# EAGLE design ARE_adaptadora_PIC_44pin (EAGLE 6.5.0)
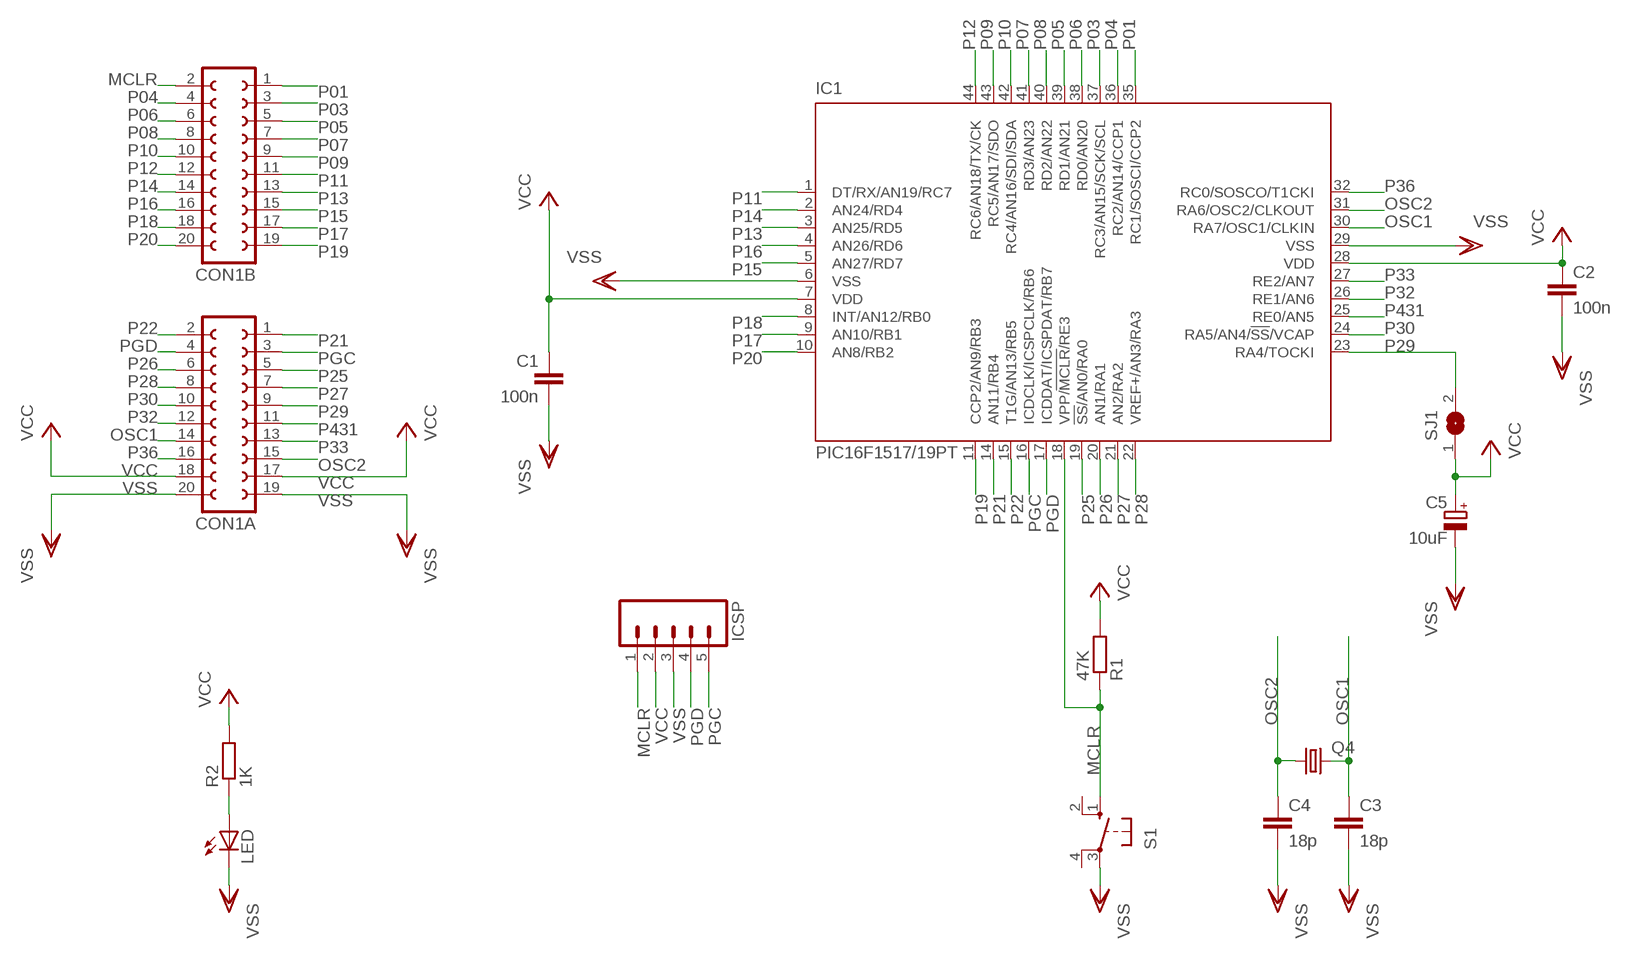
[diagram p0: schematic, sheet 1]

## Parts
C1  100n  C-EUC0805  [C0805]
C2  100n  C-EUC0805  [C0805]
C3  18p  C-EUC0805  [C0805]
C4  18p  C-EUC0805  [C0805]
C5  10uF  CPOL-EUSMCC  [SMC_C]
CON1A  FE10-2W  [FE10-2W]
CON1B  FE10-2W  [FE10-2W]
IC1  PIC16F1517/19PT  [TQFP44]
ICSP  M05PTH  [1X05]
LED  LEDCHIPLED_0805  [CHIPLED_0805]
Q4  CRYSTALHC18U-V  [HC18U-V]
R1  47K  R-EU_R0805  [R0805]
R2  1K  R-EU_R0805  [R0805]
S1  10-XX  [B3F-10XX]
SJ1  SJ  [SJ]

## Nets
MCLR: CON1B.2 IC1.18(VPP/!MCLR!/RE3) ICSP.1 R1.1 S1.1(S)
N$4: LED.A R2.1
OSC1: C3.1 CON1A.14 IC1.30(RA7/OSC1/CLKIN) Q4.2
OSC2: C4.1 CON1A.15 IC1.31(RA6/OSC2/CLKOUT) Q4.1
P01: CON1B.1 IC1.35(RC1/SOSCI/CCP2)
P03: CON1B.3 IC1.37(RC3/AN15/SCK/SCL)
P04: CON1B.4 IC1.36(RC2/AN14/CCP1)
P05: CON1B.5 IC1.39(RD1/AN21)
P06: CON1B.6 IC1.38(RD0/AN20)
P07: CON1B.7 IC1.41(RD3/AN23)
P08: CON1B.8 IC1.40(RD2/AN22)
P09: CON1B.9 IC1.43(RC5/AN17/SDO)
P10: CON1B.10 IC1.42(RC4/AN16/SDI/SDA)
P11: CON1B.11 IC1.1(DT/RX/AN19/RC7)
P12: CON1B.12 IC1.44(RC6/AN18/TX/CK)
P13: CON1B.13 IC1.3(AN25/RD5)
P14: CON1B.14 IC1.2(AN24/RD4)
P15: CON1B.15 IC1.5(AN27/RD7)
P16: CON1B.16 IC1.4(AN26/RD6)
P17: CON1B.17 IC1.9(AN10/RB1)
P18: CON1B.18 IC1.8(INT/AN12/RB0)
P19: CON1B.19 IC1.11(CCP2/AN9/RB3)
P20: CON1B.20 IC1.10(AN8/RB2)
P21: CON1A.1 IC1.14(AN11/RB4)
P22: CON1A.2 IC1.15(T1G/AN13/RB5)
P25: CON1A.5 IC1.19(!SS!/AN0/RA0)
P26: CON1A.6 IC1.20(AN1/RA1)
P27: CON1A.7 IC1.21(AN2/RA2)
P28: CON1A.8 IC1.22(VREF+/AN3/RA3)
P29: CON1A.9 IC1.23(RA4/TOCKI) SJ1.2
P30: CON1A.10 IC1.24(RA5/AN4/!SS!/VCAP)
P32: CON1A.12 IC1.26(RE1/AN6)
P33: CON1A.13 IC1.27(RE2/AN7)
P36: CON1A.16 IC1.32(RC0/SOSCO/T1CKI)
P431: CON1A.11 IC1.25(RE0/AN5)
PGC: CON1A.3 IC1.16(ICDCLK/ICSPCLK/RB6) ICSP.5
PGD: CON1A.4 IC1.17(ICDDAT/ICSPDAT/RB7) ICSP.4
VCC: C1.1 C2.1 C5.+ CON1A.17 CON1A.18 IC1.7(VDD) IC1.28(VDD) ICSP.2 R1.2 R2.2 SJ1.1
VSS: C1.2 C2.2 C3.2 C4.2 C5.- CON1A.19 CON1A.20 IC1.6(VSS) IC1.29(VSS) ICSP.3 LED.C S1.3(P)
Unconnected: S1.2(S1) S1.4(P1)

## Library data of the parts
C1-C4 = rcl:C-EU: CAPACITOR, European symbol
C5 = rcl:CPOL-EU: POLARIZED CAPACITOR, European symbol
CON1A CON1B = con-lsta:FE10-2W: FEMALE HEADER; OC_FARNELL: unknown; OC_NEWARK: unknown
IC1 = microchip:PIC16*F1517/19: 28/40/44-Pin Flash Microcontrollers with nanoWatt XLP Technology PIC16F1517/1519 AND PIC16LF1517/1519 Source: www.microchip.com PIC16F1516.pdf
ICSP = SparkFun:M05: Header 5 Standard 5-pin 0.1" header. Use with straight break away headers (SKU : PRT-00116), right angle break away headers (PRT-00553), swiss pins (PRT-00743), machine pins (PRT-00117), and female headers (PRT-00115). Molex polarized connector foot print use with SKU : PRT-08230 with associated crimp pins and housings.
LED = led:LED: LED OSRAM: - CHIPLED LG R971, LG N971, LY N971, LG Q971, LY Q971, LO R971, LY R971 LH N974, LH R974 LS Q976, LO Q976, LY Q976 LO Q996 - Hyper CHIPLED LW Q18S LB Q993, LB Q99A, LB R99A - SideLED LS A670, LO A670, LY A670, LG A670, LP A670 LB A673, LV A673, LT A673, LW A673 LH A674 LY A675 LS A676, LA A676, LO A676, LY A676, LW A676 LS A679, LY A679, LG A679 - Hyper Micro SIDELED® LS Y876, LA Y876, LO Y876, LY Y876 LT Y87S - SmartLED LW L88C, LW L88S LB L89C, LB L89S, LG L890 LS L89K, LO L89K, LY L89K LS L896, LA L896, LO L896, LY L896 - TOPLED LS T670, LO T670, LY T670, LG T670, LP T670 LSG T670, LSP T670, LSY T670, LOP T670, LYG T670 LG T671, LOG T671, LSG T671 LB T673, LV T673, LT T673, LW T673 LH T674 LS T676, LA T676, LO T676, LY T676, LB T676, LH T676, LSB T676, LW T676 LB T67C, LV T67C, LT T67C, LS T67K, LO T67K, LY T67K, LW E67C LS E67B, LA E67B, LO E67B, LY E67B, LB E67C, LV E67C, LT E67C LW T67C LS T679, LY T679, LG T679 LS T770, LO T770, LY T770, LG T770, LP T770 LB T773, LV T773, LT T773, LW T773 LH T774 LS E675, LA E675, LY E675, LS T675 LS T776, LA T776, LO T776, LY T776, LB T776 LHGB T686 LT T68C, LB T68C - Hyper Mini TOPLED® LB M676 - Mini TOPLED Santana® LG M470 LS M47K, LO M47K, LY M47K Source: http://www.osram.convergy.de LUXEON: - LUMILED® LXK2-PW12-R00, LXK2-PW12-S00, LXK2-PW14-U00, LXK2-PW14-V00 LXK2-PM12-R00, LXK2-PM12-S00, LXK2-PM14-U00 LXK2-PE12-Q00, LXK2-PE12-R00, LXK2-PE12-S00, LXK2-PE14-T00, LXK2-PE14-U00 LXK2-PB12-K00, LXK2-PB12-L00, LXK2-PB12-M00, LXK2-PB14-N00, LXK2-PB14-P00, LXK2-PB14-Q00 LXK2-PR12-L00, LXK2-PR12-M00, LXK2-PR14-Q00, LXK2-PR14-R00 LXK2-PD12-Q00, LXK2-PD12-R00, LXK2-PD12-S00 LXK2-PH12-R00, LXK2-PH12-S00 LXK2-PL12-P00, LXK2-PL12-Q00, LXK2-PL12-R00 Source: www.luxeon.com KINGBRIGHT: KA-3528ASYC Source: www.kingbright.com
Q4 = crystal:CRYSTAL: CRYSTAL; OC_FARNELL: unknown; OC_NEWARK: unknown
R1 R2 = rcl:R-EU_: RESISTOR, European symbol
S1 = switch-omron:10-XX: OMRON SWITCH; MPN: B3F-1000; OC_FARNELL: 176432; OC_NEWARK: 36M3542
SJ1 = jumper:SJ: SMD solder JUMPER

## Board
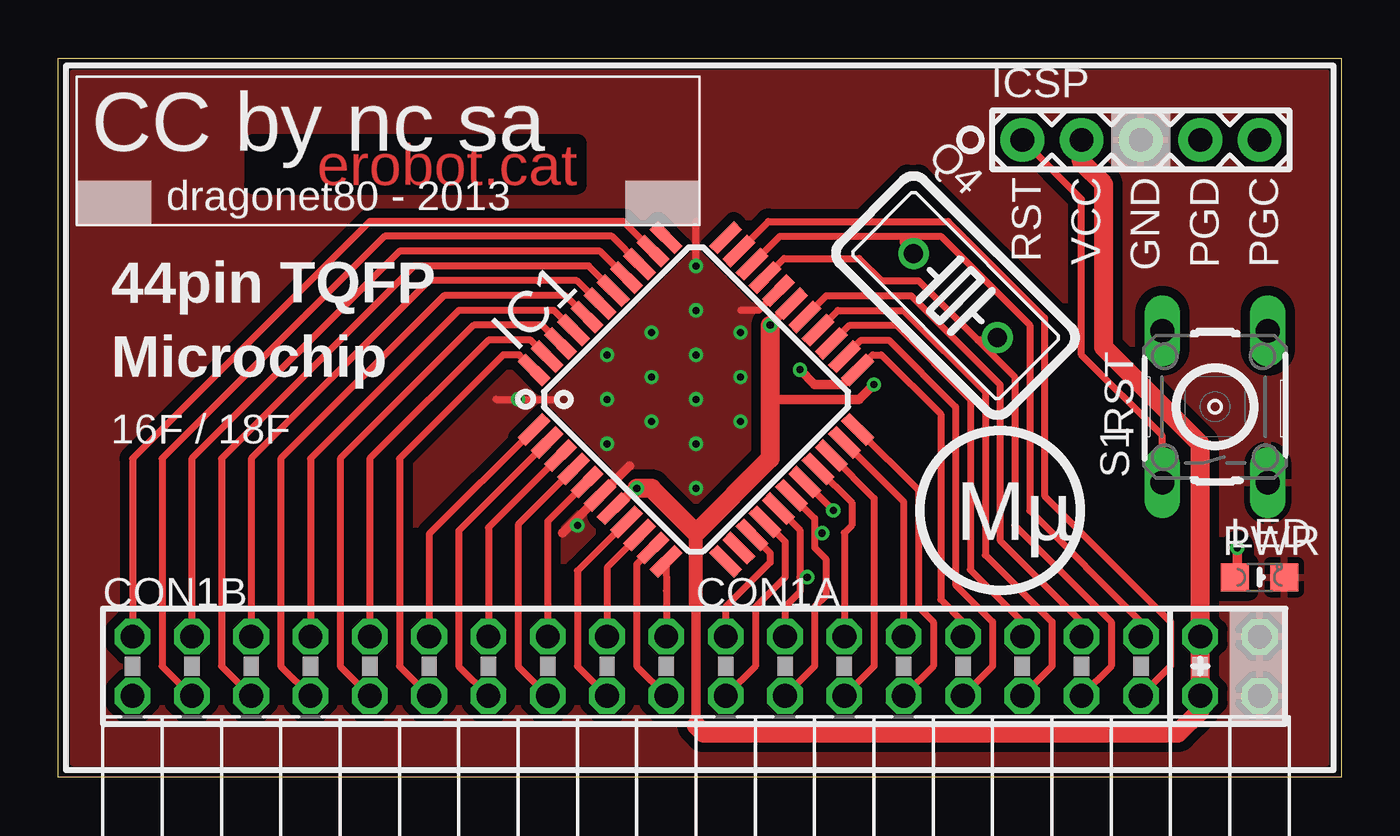
[diagram p1: board, top side]
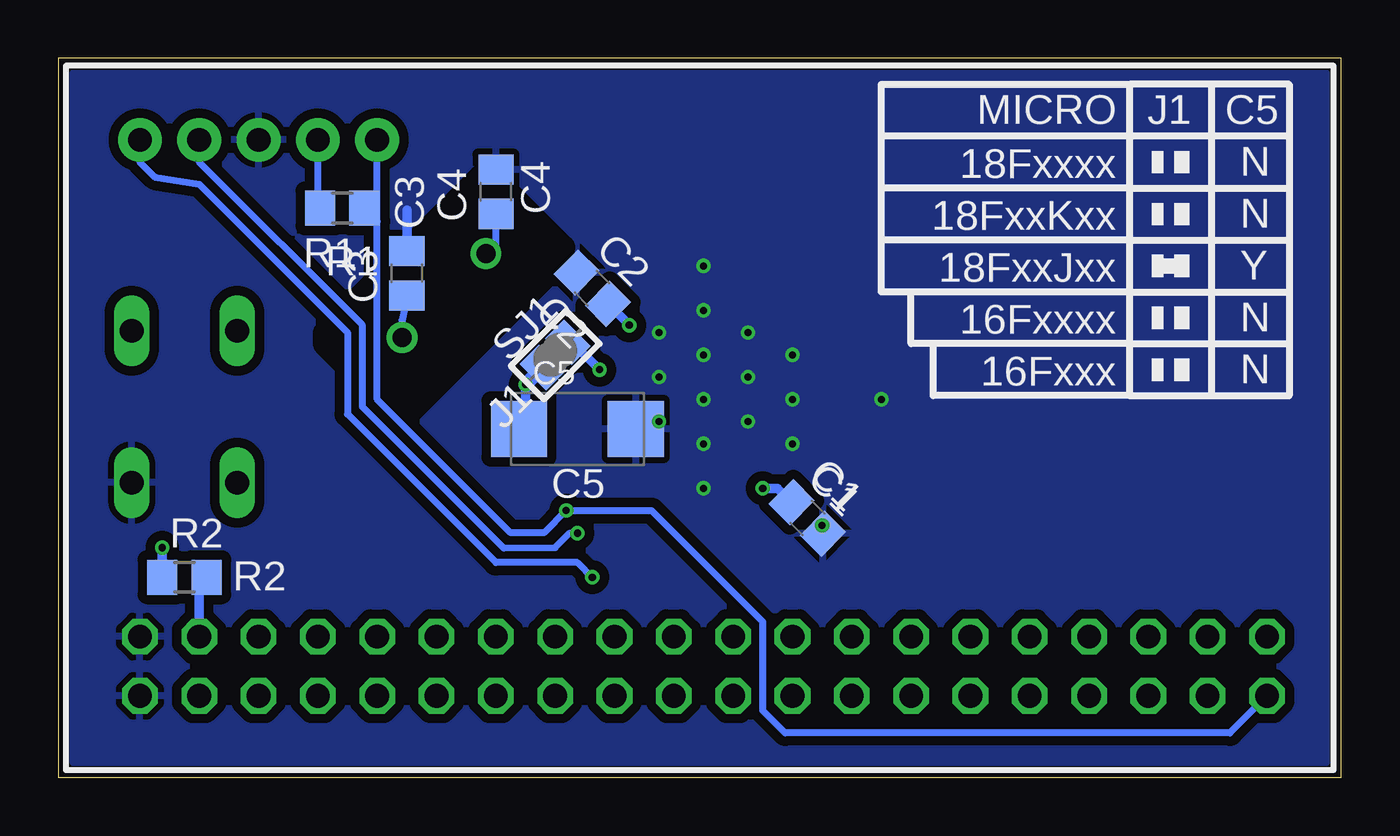
[diagram p2: board, bottom side, seen from below]

Size 54.93 x 30.8 mm. Coordinates in mm from the lower left corner, seen from the top.
Outline: 0,30.8 54.93,30.8 54.93,0 0,0 0,30.8
Copper layers (1*16): Top 0.035mm / dielectric 1.5mm / Bottom 0.035mm
Design rules "ITEADstudio_DRC": minimum track width 6mil, minimum drill 12mil, track to track 6mil, track to pad 6mil, pad to pad 6mil, via to via 6mil, smd to smd 0mil, copper to edge 10mil, drill to drill 10mil, minimum pad ring 10mil, minimum via ring 6mil, stop-mask expansion 2mil, vias tented up to drill 100mil, thermal gap 10mil
tRestrict: area 33.3,15.6 to 43.5,25.7
bRestrict: area 33.3,15.6 to 43.5,25.7

### Footprints (pad centres in the part's own frame; a part is rotated, then mirrored left to right if it is on the bottom)
C0805 = smd 1.3 x 1.5: 1 -0.95,0; 2 0.95,0
SMC_C = smd 2.4 x 2.4: + -2.5,0; - 2.5,0
FE10-2W = drill 1.016 octagon: 1 -11.43,1.27; 2 -11.43,-1.27; 3 -8.89,1.27; 4 -8.89,-1.27; 5 -6.35,1.27; 6 -6.35,-1.27; 7 -3.81,1.27; 8 -3.81,-1.27; 9 -1.27,1.27; 10 -1.27,-1.27; 11 1.27,1.27; 12 1.27,-1.27; 13 3.81,1.27; 14 3.81,-1.27; 15 6.35,1.27; 16 6.35,-1.27; 17 8.89,1.27; 18 8.89,-1.27; 19 11.43,1.27; 20 11.43,-1.27
TQFP44 = smd 1.5 x 0.5: 1 -5.8,4; 2 -5.8,3.2; 3 -5.8,2.4; 4 -5.8,1.6; 5 -5.8,0.8; 6 -5.8,0; 7 -5.8,-0.8; 8 -5.8,-1.6; 9 -5.8,-2.4; 10 -5.8,-3.2; 11 -5.8,-4; 23 5.8,-4; 24 5.8,-3.2; 25 5.8,-2.4; 26 5.8,-1.6; 27 5.8,-0.8; 28 5.8,0; 29 5.8,0.8; 30 5.8,1.6; 31 5.8,2.4; 32 5.8,3.2; 33 5.8,4 | smd 0.5 x 1.5: 12 -4,-5.8; 13 -3.2,-5.8; 14 -2.4,-5.8; 15 -1.6,-5.8; 16 -0.8,-5.8; 17 0,-5.8; 18 0.8,-5.8; 19 1.6,-5.8; 20 2.4,-5.8; 21 3.2,-5.8; 22 4,-5.8; 34 4,5.8; 35 3.2,5.8; 36 2.4,5.8; 37 1.6,5.8; 38 0.8,5.8; 39 0,5.8; 40 -0.8,5.8; 41 -1.6,5.8; 42 -2.4,5.8; 43 -3.2,5.8; 44 -4,5.8
1X05 = drill 1.016 pad 1.88: 1 0,0; 2 2.54,0; 3 5.08,0; 4 7.62,0; 5 10.16,0
CHIPLED_0805 = smd 1.2 x 1.2: A 0,-1.05; C 0,1.05
HC18U-V = drill 0.813: 1 -2.54,0; 2 2.54,0
R0805 = smd 1.3 x 1.5: 1 -0.95,0; 2 0.95,0
B3F-10XX = drill 1.016 long: 1 -3.251,2.261; 2 3.251,2.261; 3 -3.251,-2.261; 4 3.251,-2.261
SJ = smd 1.168 x 1.6: 1 -0.762,0; 2 0.762,0

### Placement (x,y rotation side)
C1  22.86,11.11 315 bottom
C2  32.07,20.96 135 bottom
C3  40,21.59 90 bottom
C4  36.19,25.08 90 bottom
C5  32.7,14.92 0 bottom
CON1A  40,4.76 0 top
CON1B  14.6,4.76 0 top
IC1  27.3,16.18 45 top
ICSP  41.27,27.31 0 top
LED  51.44,8.57 270 top
Q4  38.42,20.64 315 top
R1  42.77,24.38 180 bottom
R2  49.53,8.57 0 bottom
S1  49.53,15.88 90 top
SJ1  33.66,18.1 45 bottom

### Tracks (layer width: path | path; a pad name or v marks a point on that pad's centre or on a via)
MCLR  (via drill 0.3 pad 0.61)
  Top 0.305: IC1.18 v33.18,11.43 | S1.1 47.27,14.64 43.81,18.1 43.81,24.76 ICSP.1
  Bottom 0.305: 41.27,23.81 41.27,16.19 35.56,10.48 34.13,10.48 v33.18,11.43 29.53,11.43 24.77,6.67 24.77,2.86 23.81,1.9 4.76,1.9 CON1B.2 | R1.1 41.5,24.06 41.27,23.81 | 41.27,23.81 ICSP.1
N$4  (via drill 0.3 pad 0.61)
  Top 0.406: v50.48,9.84 50.48,8.89 LED.A
  Bottom 0.406: R2.1 v50.48,9.84
OSC1
  Top 0.305: IC1.30 31.08,22.22 34.29,22.22 35.24,21.27 36.83,21.27 39.37,18.73 | CON1A.14 45.08,4.76 45.08,6.67 40.96,10.79 40.96,17.14 39.37,18.73 | Q4.2 40.11,18.73 39.37,18.73
  Bottom 0.305: C3.1 40.21,19.57 Q4.2
OSC2
  Top 0.305: IC1.31 30.9,23.18 36.19,23.18 | 36.19,23.18 37.78,23.18 41.59,19.37 41.59,11.43 46.36,6.67 CON1A.15 | Q4.1 36.19,22.86 36.19,23.18
  Bottom 0.305: Q4.1 36.19,22.86 C4.1
P01
  Top 0.305: IC1.35 24.19,23.81 13.33,23.81 3.17,13.65 CON1B.1
P03
  Top 0.305: IC1.37 23.2,22.54 14.6,22.54 5.71,13.65 CON1B.3
P04
  Top 0.305: IC1.36 23.7,23.18 13.97,23.18 4.45,13.65 4.45,4.76 CON1B.4
P05
  Top 0.305: IC1.39 22.21,21.27 15.88,21.27 8.25,13.65 CON1B.5
P06
  Top 0.305: IC1.38 22.7,21.91 15.24,21.91 6.98,13.65 6.98,4.76 CON1B.6
P07
  Top 0.305: IC1.41 21.22,20 17.14,20 10.79,13.65 CON1B.7
P08
  Top 0.305: IC1.40 21.71,20.64 16.51,20.64 9.52,13.65 9.52,4.76 CON1B.8
P09
  Top 0.305: IC1.43 20.22,18.73 18.41,18.73 13.33,13.65 CON1B.9
P10
  Top 0.305: IC1.42 20.72,19.37 17.78,19.37 12.06,13.65 12.06,4.76 CON1B.10
P11
  Top 0.305: IC1.1 15.88,10.42 CON1B.11
P12
  Top 0.305: IC1.44 19.73,18.1 19.05,18.1 14.6,13.65 14.6,4.76 CON1B.12
P13
  Top 0.305: IC1.3 18.41,10.7 CON1B.13
P14
  Top 0.305: IC1.2 17.14,10.56 17.14,4.76 CON1B.14
P15
  Top 0.305: IC1.5 20.95,10.97 CON1B.15
P16
  Top 0.305: IC1.4 19.69,10.84 19.69,4.76 CON1B.16
P17
  Top 0.305: IC1.9 23.49,8.99 CON1B.17
P18
  Top 0.305: IC1.8 22.22,8.85 22.22,4.76 CON1B.18
P19
  Top 0.305: IC1.11 26.03,8 CON1B.19
P20
  Top 0.305: IC1.10 24.77,9.13 24.77,4.76 CON1B.20
P21
  Top 0.305: IC1.14 30.48,9.61 30.48,9.21 28.58,7.3 CON1A.1
P22
  Top 0.305: IC1.15 31.11,10.1 31.11,8.57 29.84,7.3 29.84,4.76 CON1A.2
P25
  Top 0.305: IC1.19 33.97,11.77 33.97,10.79 33.66,10.48 CON1A.5
P26
  Top 0.305: IC1.20 34.92,11.95 34.92,4.76 CON1A.6
P27
  Top 0.305: IC1.21 36.19,11.81 CON1A.7
P28
  Top 0.305: IC1.22 36.83,12.31 36.83,7.3 37.47,6.67 37.47,4.76 CON1A.8
P29  (via drill 0.3 pad 0.41)
  Top 0.305: IC1.23 34.87,18.1 35.24,18.1 37.78,15.56 37.78,7.62 38.73,6.67 CON1A.9
  Top 0.406: IC1.23 33.6,16.83 32.38,16.83 v31.75,17.46
  Bottom 0.406: v31.75,17.46 32.92,18.64 SJ1.2
P30
  Top 0.305: IC1.24 34.37,18.73 35.56,18.73 38.42,15.87 38.42,8.25 40,6.67 40,4.76 CON1A.10
P32
  Top 0.305: IC1.26 33.38,20 36.19,20 39.69,16.51 39.69,9.53 42.55,6.67 42.55,4.76 CON1A.12
P33
  Top 0.305: IC1.27 32.88,20.64 36.51,20.64 40.32,16.83 40.32,10.16 43.81,6.67 CON1A.13
P36
  Top 0.305: IC1.32 30.4,23.81 38.1,23.81 42.23,19.68 42.23,12.07 47.62,6.67 47.62,4.76 CON1A.16
P431
  Top 0.305: IC1.25 33.87,19.37 35.88,19.37 39.05,16.19 39.05,8.89 41.27,6.67 CON1A.11
PGC  (via drill 0.3 pad 0.61)
  Top 0.305: IC1.16 31.75,10.6 31.75,8.57 | 31.75,8.57 31.75,7.94 31.11,7.3 CON1A.3 | v32.07,8.57 31.75,8.57
  Bottom 0.305: ICSP.5 51.44,26.35 50.8,25.72 48.89,25.4 42.55,19.05 42.55,15.56 36.19,9.21 32.7,9.21 v32.07,8.57
PGD  (via drill 0.3 pad 0.61)
  Top 0.305: IC1.17 32.38,11.1 32.38,10.46 | 32.38,10.46 32.38,9.84 32.86,9.37 32.86,7.78 32.38,7.3 32.38,4.76 CON1A.4 | v32.7,10.46 32.38,10.46
  Bottom 0.305: ICSP.4 48.89,26.35 41.91,19.37 41.91,15.87 35.86,9.83 33.66,9.84 33.04,10.46 v32.7,10.46
VCC  (via drill 0.3 pad 0.41, 0.3 pad 0.61)
  Top 0.406: IC1.7 24.13,11.89 v24.77,12.38 | IC1.28 v30.48,19.37 | v30.48,19.37 | 30.48,16.19 34.29,16.19 | 34.29,16.19 | v34.92,16.83 34.29,16.19 | 27.3,2.22 27.3,7.3
  Top 0.61: 27.3,7.3 27.3,10.48 | v34.92,16.83
  Top 0.813: v24.77,12.38 25.4,12.38 27.3,10.48 30.48,13.65 30.48,16.19 v30.48,19.37 | 27.3,2.22 27.62,1.9 47.94,1.9 48.89,2.86 CON1A.18 CON1A.17 48.89,14.29 44.77,18.42 44.77,25.4 43.81,26.35 ICSP.2
  Bottom 0.305: R1.2 43.81,24.48 ICSP.2
  Bottom 0.406: C1.1 24.13,12.38 v24.77,12.38 | IC1.28 v30.48,19.37 | v34.92,16.83 | C5.+ 34.92,14.92 v34.92,16.83 | R2.2 48.89,8.25 CON1A.17
  Bottom 0.61: SJ1.1 v34.92,16.83
VSS  (via drill 0.3 pad 0.61)
  Top 0.305: 18.73,16.19 21.27,16.19 | IC1.29 29.98,20 29.21,20 | v27.3,21.91 27.3,23.81 | 23.18,12.07 IC1.6 | 21.59,10.48
  Top 0.406: IC1.6 24.45,13.33 | 24.45,13.33 | 21.59,10.48 23.18,12.07 | 23.18,12.07
  Bottom 0.406: C3.2 40,24.29
  other vias: 22.22,10.8 27.3,12.38 23.49,14.29 27.3,16.19 19.69,16.19 25.4,19.05 29.21,19.05 29.21,17.15 27.3,14.29 27.3,18.1 27.3,20 29.21,15.24 25.4,15.24 25.4,17.15 23.49,18.1 23.49,16.19
  pour Bottom (isolate 0.406): 0.63,0.64 54.29,0.64 54.29,30.16 0.63,30.16
  pour Top (isolate 0.406): 0.63,0.64 54.29,0.64 54.29,30.16 0.63,30.16

### Text on the board
Top: erobot.cat
_tsilk: CC by nc sa | RST | VCC | GND | PGD | PGC | dragonet80 - 2013 | 44pin TQFP | Microchip | RST | 16F / 18F | Mµ | PWR
_bsilk: C5 | J1 | MICRO | 18Fxxxx | N | 18FxxKxx | N | C4 | C2 | C3 | 18FxxJxx | Y | R1 | 16Fxxxx | N | 16Fxxx | N | J1 | C1 | C5 | R2